# Altium project GRLV_Double_30v_v0.2.PrjPcb
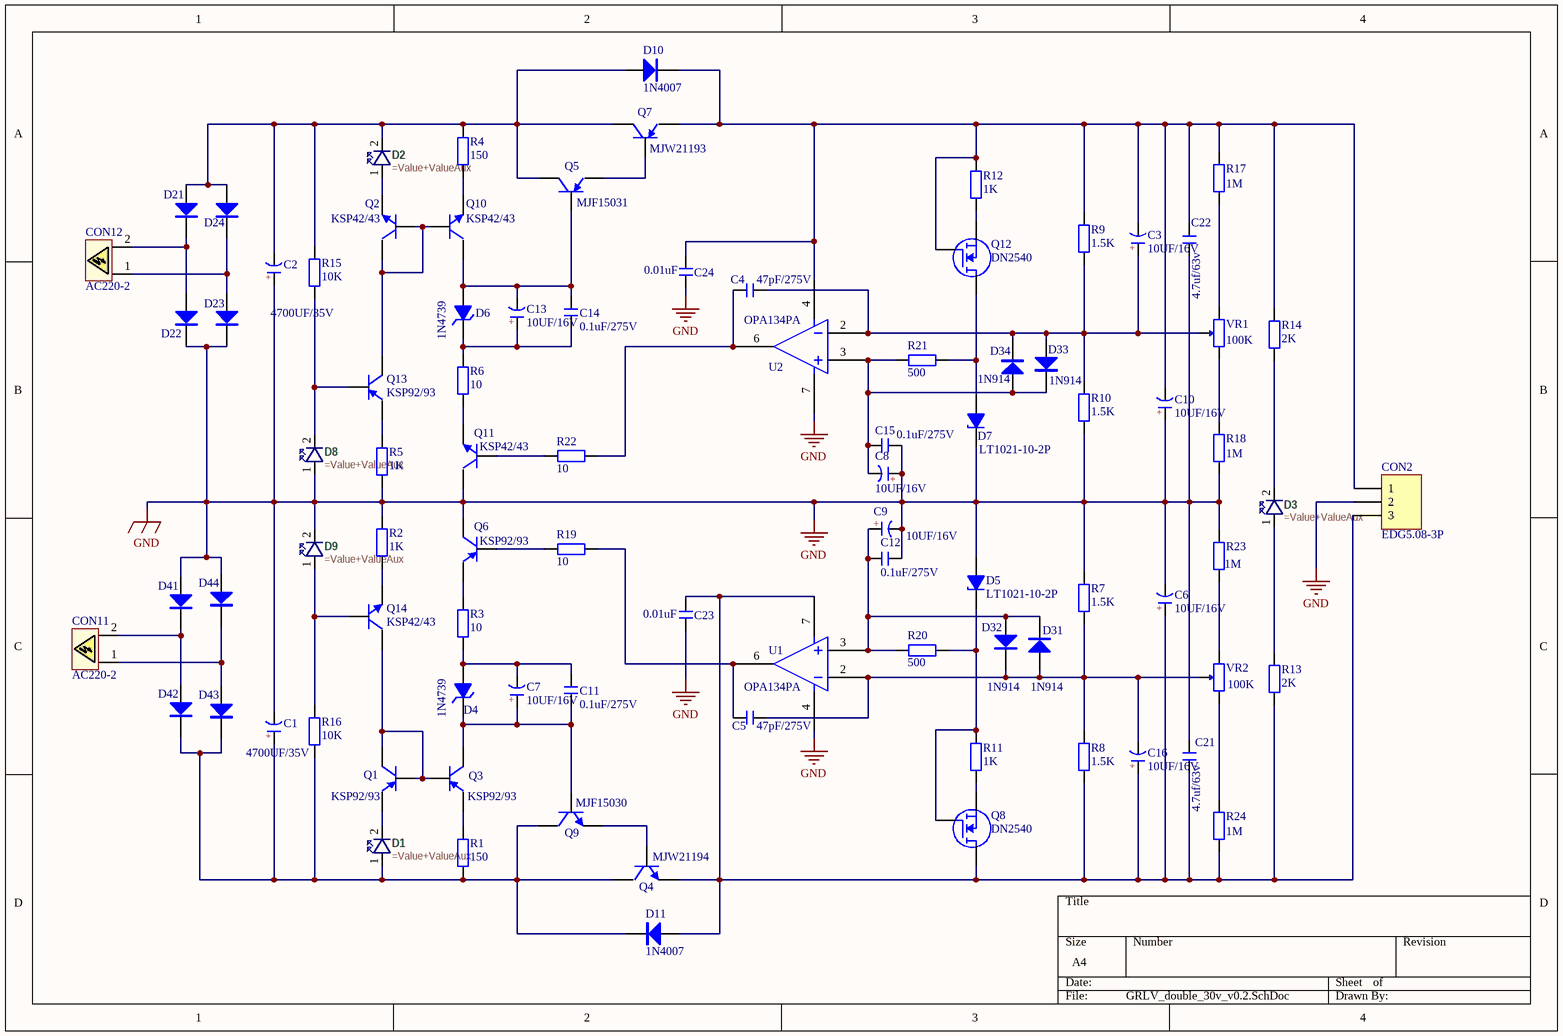
[diagram p0: GRLV_double_30v_v0.2.SchDoc]
1 sheet, 88 parts. Net scope: global (net labels, ports and power ports of the same name join across sheets).
Board file: GRLV_Double_30v_v0.2.PcbDoc

## Sheet GRLV_double_30v_v0.2.SchDoc
size A4

### Parts
C1  4700UF/35V  [CAP 11*35*60]
C2  4700UF/35V  [CAP 11*35*60]
C3  10UF/16V  [CAP 1.5*4*8]
C4  47pF/275V  [CBB 6.3*6.3*5]
C5  47pF/275V  [CBB 6.3*6.3*5]
C6  10UF/16V  [CAP 3.5*8*11.5]
C7  10UF/16V  [CAP 1.5*4*8]
C8  10UF/16V  [CAP 1.5*4*8]
C9  10UF/16V  [CAP 1.5*4*8]
C10  10UF/16V  [CAP 3.5*8*11.5]
C11  0.1uF/275V  [CBB 6.3*6.3*5]
C12  0.1uF/275V  [CBB 6.3*6.3*5]
C13  10UF/16V  [CAP 1.5*4*8]
C14  0.1uF/275V  [CBB 6.3*6.3*5]
C15  0.1uF/275V  [CBB 6.3*6.3*5]
C16  10UF/16V  [CAP 1.5*4*8]
C21  4.7uf/63v  [CBB 7.2*7.2*13]
C22  4.7uf/63v  [CBB 7.2*7.2*13]
C23  value 0.01uF  [CBB 6.3*6.3*5]  (hidden comment: 0.01uF/275V)
C24  value 0.01uF  [CBB 6.3*6.3*5]  (hidden comment: 0.01uF/275V)
CON2  EDG5.08-3P  [HX5.08-3S]
CON11  AC220-2  [HX5.08-2L]
CON12  AC220-2  [HX5.08-2L]
D1  (no value)  [LED 3MM-R]
D2  (no value)  [LED 3MM-R]
D3  (no value)  [LED 3MM-R]
D4  1N4739  [DO-41]
D5  LT1021-10-2P  [DIP8-300_MH]
D6  1N4739  [DO-41]
D7  LT1021-10-2P  [DIP8-300_MH]
D8  (no value)  [LED 3MM-R]
D9  (no value)  [LED 3MM-R]
D10  1N4007  [DO-41]
D11  1N4007  [DO-41]
D21  VS-HFA08TB60-M3  [TO220AC]  (value not drawn)
D22  VS-HFA08TB60-M3  [TO220AC]  (value not drawn)
D23  VS-HFA08TB60-M3  [TO220AC]  (value not drawn)
D24  VS-HFA08TB60-M3  [TO220AC]  (value not drawn)
D31  1N914  [DO-35]
D32  1N914  [DO-35]
D33  1N914  [DO-35]
D34  1N914  [DO-35]
D41  VS-HFA08TB60-M3  [TO220AC]  (value not drawn)
D42  VS-HFA08TB60-M3  [TO220AC]  (value not drawn)
D43  VS-HFA08TB60-M3  [TO220AC]  (value not drawn)
D44  VS-HFA08TB60-M3  [TO220AC]  (value not drawn)
Q1  KSP92/93  [TO92A]
Q2  KSP42/43  [TO92A]
Q3  KSP92/93  [TO92A]
Q4  MJW21194  [TO247V]
Q5  MJF15031  [TO220V]
Q6  KSP92/93  [TO92A]
Q7  MJW21193  [TO247V]
Q8  DN2540  [TO92A]
Q9  MJF15030  [TO220V]
Q10  KSP42/43  [TO92A]
Q11  KSP42/43  [TO92A]
Q12  DN2540  [TO92A]
Q13  KSP92/93  [TO92A]
Q14  KSP42/43  [TO92A]
R1  150  [RS 1/4W]
R2  1K  [RS 1/4W]
R3  10  [RS 1/4W]
R4  150  [RS 1/4W]
R5  1K  [RS 1/4W]
R6  10  [RS 1/4W]
R7  1.5K  [RS 1/4W]
R8  1.5K  [RS 1/4W]
R9  1.5K  [RS 1/4W]
R10  1.5K  [RS 1/4W]
R11  1K  [RS 1/4W]
R12  1K  [RS 1/4W]
R13  2K  [RS 1/4W]
R14  2K  [RS 1/4W]
R15  10K  [RS 1/4W]
R16  10K  [RS 1/4W]
R17  1M  [RS 1/4W]
R18  1M  [RS 1/4W]
R19  10  [RS 1/4W]
R20  500  [RS 1/4W]
R21  500  [RS 1/4W]
R22  10  [RS 1/4W]
R23  1M  [RS 1/4W]
R24  1M  [RS 1/4W]
U1  OPA134PA  [DIP8-300_MH]
U2  OPA134PA  [DIP8-300_MH]
VR1  value 100K  [RS 1/2W-VR]  (hidden comment: VR-W)
VR2  value 100K  [RS 1/2W-VR]  (hidden comment: VR-W)

### Nets
GND: C1.2(K) C2.1(A) C6.2(K) C8.1(A) C9.2(K) C10.1(A) C12.2 C15.2 C21.2 C22.1 C23.1 C24.1 CON2.2 D5.4(A) D7.6(K) D8.1(A) D9.2(K) D22.1(Cathode) D23.1(Cathode) D41.2(Anode) D44.2(Anode) Q6.3(C) Q11.3(C) R2.2 R5.1 R7.2 R10.1 R18.1 R23.2 U1.4(V-) U2.7(V+)
NetC1_1: C1.1(A) D1.1(A) D11.2(K) D42.1(Cathode) D43.1(Cathode) Q4.2(C) Q9.2(C) R1.1 R16.1
NetC2_2: C2.2(K) D2.2(K) D10.1(A) D21.2(Anode) D24.2(Anode) Q5.2(C) Q7.2(C) R4.2 R15.2
NetC3_1: C3.1(A) C4.2 D33.1(A) D34.2(K) R9.1 R10.2 U2.2(-in) VR1.3
NetC3_2: C3.2(K) C10.2(K) C22.2 C24.2 CON2.1 D10.2(K) Q7.3(E) Q12.2(G) R9.2 R12.2 R14.2 R17.2 U2.4(V-)
NetC4_1: C4.1 R22.2 U2.6(out)
NetC5_1: C5.1 R19.2 U1.6(out)
NetC5_2: C5.2 C16.2(K) D31.1(A) D32.2(K) R7.1 R8.2 U1.2(-in) VR2.3
NetC6_1: C6.1(A) C16.1(A) C21.1 C23.2 CON2.3 D11.1(A) Q4.3(E) Q8.3(D) R8.1 R13.2 R24.1 U1.7(V+)
NetC7_1: C7.1(A) C11.1 D4.2(K) Q3.3(C) Q9.1(B)
NetC7_2: C7.2(K) C11.2 D4.1(A) R3.1
NetC8_2: C8.2(K) C15.1 D33.2(K) D34.1(A) R21.1 U2.3(+in)
NetC9_1: C9.1(A) C12.1 D31.2(K) D32.1(A) R20.1 U1.3(+in)
NetC13_1: C13.1(A) C14.1 D6.2(K) R6.2
NetC13_2: C13.2(K) C14.2 D6.1(A) Q5.1(B) Q10.3(C)
NetCON11_1: CON11.1(L) D43.2(Anode) D44.1(Cathode)
NetCON11_2: CON11.2(G) D41.1(Cathode) D42.2(Anode)
NetCON12_1: CON12.1(L) D23.2(Anode) D24.1(Cathode)
NetCON12_2: CON12.2(G) D21.1(Cathode) D22.2(Anode)
NetD1_2: D1.2(K) Q1.1(E)
NetD2_1: D2.1(A) Q2.1(E)
NetD3_1: D3.1(A) R13.1
NetD3_2: D3.2(K) R14.1
NetD5_6: D5.6(K) Q8.2(G) R11.2 R20.2
NetD7_4: D7.4(A) Q12.3(D) R21.2
NetD8_2: D8.2(K) Q13.2(B) R15.1
NetD9_1: D9.1(A) Q14.2(B) R16.2
NetQ1_2: Q1.2(B) Q1.3(C) Q3.2(B) Q14.3(C)
NetQ2_2: Q2.2(B) Q2.3(C) Q10.2(B) Q13.3(C)
NetQ3_1: Q3.1(E) R1.2
NetQ4_1: Q4.1(B) Q9.3(E)
NetQ5_3: Q5.3(E) Q7.1(B)
NetQ6_1: Q6.1(E) R3.2
NetQ6_2: Q6.2(B) R19.1
NetQ8_1: Q8.1(S) R11.1
NetQ10_1: Q10.1(E) R4.1
NetQ11_1: Q11.1(E) R6.1
NetQ11_2: Q11.2(B) R22.1
NetQ12_1: Q12.1(S) R12.1
NetQ13_1: Q13.1(E) R5.2
NetQ14_1: Q14.1(E) R2.1
NetR17_1: R17.1 VR1.2
NetR18_2: R18.2 VR1.1
NetR23_1: R23.1 VR2.2
NetR24_2: R24.2 VR2.1

### Notes on the sheet
- (in symbol C-CAP) +

### Library data of the parts
C1-C3 C6-C10 C13 C16 = C-CAP: 直插电解电容; 版权归属: 源创客; BOM名称: 直插电解电容; 学习资源: www.ooocke.com
C4 C5 C11 C12 C14 C15 C23 C24 = C-CBB: CBB电容; 版权归属: 源创客; BOM名称: CBB电容; 学习资源: www.ooocke.com
C21 C22 = C-MKS: MKS薄膜电容
D1-D3 D8 D9 = LED: 直插式LED
D4 D6 = 1N4739: 9.1V/1W稳压管
D5 D7 = LT1021-10-2P: 10V Precision Reference 2 Pin Config
D10 D11 = 1N4007: 整流二极管; 版权归属: 源创客; BOM名称: 整流二极管; 学习资源: www.ooocke.com
D21-D24 D41-D44 = VS-HFA08TB60-M3: Ultrafast Soft Recovery Diado 8A 600V
D31-D34 = 1N914: 高速开关管 1V/0.25W
Q1 Q3 Q6 Q13 = KSP92/93: High Voltage PNP Transistor
Q2 Q10 Q11 Q14 = KSP42/43: High Voltage NPN Transistor
Q4 = MJW21194: Power NPN Transistor
Q5 = MJF15031: Power PNP Transistor
Q7 = MJW21193: Power PNP Transistor
Q8 Q12 = DN2540: N沟道耗尽型DMOS场效应管 400V/150ma
Q9 = MJF15030: Power NPN Transistor
R1-R24 = R-CRR: 直插色环电阻; BOM名称: 色环电阻; 版权归属: 源创客; 学习资源: www.ooocke.com
  R4: Value: 150
  R9: Value: 1.5K
  R17 R18 R23 R24: Value: 1M
VR1 VR2 = VR-W: 直插可调电阻-顶调